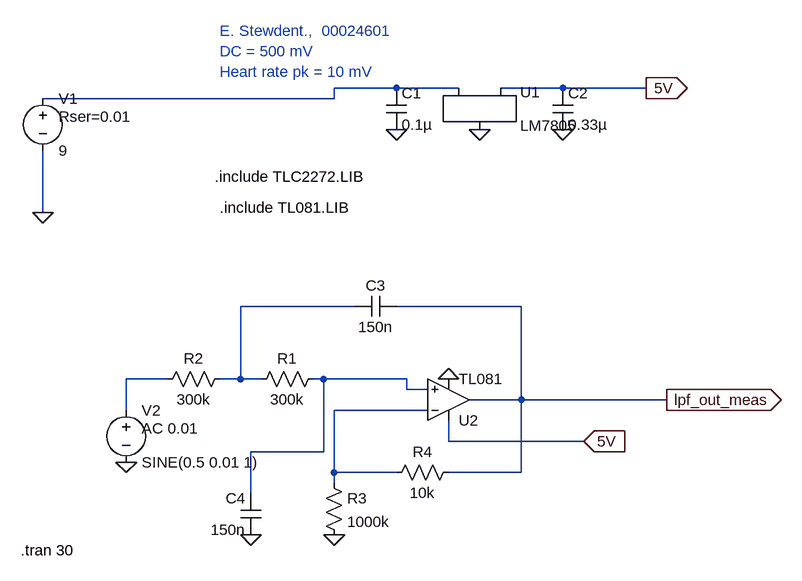
[diagram p0: schematic Test.asc]
Test.asc, the LTspice schematic file:
Version 4
SHEET 1 2136 680
WIRE 368 -1104 272 -1104
WIRE 464 -1104 368 -1104
WIRE 624 -1104 528 -1104
WIRE 752 -1104 624 -1104
WIRE 272 -1088 272 -1104
WIRE 272 -1088 -176 -1088
WIRE -176 -912 -176 -1008
WIRE 304 -768 128 -768
WIRE 560 -768 368 -768
WIRE 16 -656 -48 -656
WIRE 128 -656 128 -768
WIRE 128 -656 96 -656
WIRE 160 -656 128 -656
WIRE 256 -656 240 -656
WIRE 384 -656 256 -656
WIRE 384 -640 384 -656
WIRE 416 -640 384 -640
WIRE 560 -624 560 -768
WIRE 560 -624 480 -624
WIRE 784 -624 560 -624
WIRE -48 -608 -48 -656
WIRE 416 -608 272 -608
WIRE 448 -560 448 -592
WIRE 656 -560 448 -560
WIRE 256 -544 256 -656
WIRE 256 -544 144 -544
WIRE 272 -512 272 -608
WIRE 368 -512 272 -512
WIRE 560 -512 560 -624
WIRE 560 -512 448 -512
WIRE 272 -496 272 -512
WIRE 144 -480 144 -544
FLAG 496 -1040 0
FLAG 368 -1040 0
FLAG 624 -1040 0
FLAG 752 -1104 5V
IOPIN 752 -1104 Out
FLAG 448 -656 0
FLAG 144 -416 0
FLAG 272 -416 0
FLAG 656 -560 5V
IOPIN 656 -560 In
FLAG -176 -912 0
FLAG 784 -624 lpf_out_meas
IOPIN 784 -624 Out
FLAG -48 -528 0
SYMBOL LM7805 496 -1088 R0
SYMATTR InstName U1
SYMBOL cap 352 -1104 R0
SYMATTR InstName C1
SYMATTR Value 0.1µ
SYMBOL cap 608 -1104 R0
SYMATTR InstName C2
SYMATTR Value 0.33µ
SYMBOL Opamps\\opamp2 448 -560 M180
SYMATTR InstName U2
SYMATTR Value TL081
SYMBOL res 144 -640 R270
WINDOW 0 32 56 VTop 2
WINDOW 3 0 56 VBottom 2
SYMATTR InstName R1
SYMATTR Value 300k
SYMBOL res 0 -640 R270
WINDOW 0 32 56 VTop 2
WINDOW 3 0 56 VBottom 2
SYMATTR InstName R2
SYMATTR Value 300k
SYMBOL cap 368 -784 R90
WINDOW 0 0 32 VBottom 2
WINDOW 3 32 32 VTop 2
SYMATTR InstName C3
SYMATTR Value 150n
SYMBOL cap 160 -416 R180
WINDOW 0 24 56 Left 2
WINDOW 3 24 8 Left 2
SYMATTR InstName C4
SYMATTR Value 150n
SYMBOL res 256 -512 R0
SYMATTR InstName R3
SYMATTR Value 1000k
SYMBOL res 464 -528 R90
WINDOW 0 0 56 VBottom 2
WINDOW 3 32 56 VTop 2
SYMATTR InstName R4
SYMATTR Value 10k
SYMBOL voltage -176 -1104 R0
WINDOW 123 0 0 Left 0
WINDOW 39 24 44 Left 2
SYMATTR SpiceLine Rser=0.01
SYMATTR InstName V1
SYMATTR Value 9
SYMBOL voltage -48 -624 R0
WINDOW 123 24 44 Left 2
WINDOW 39 0 0 Left 0
SYMATTR Value2 AC 0.01
SYMATTR InstName V2
SYMATTR Value SINE(0.5 0.01 1)
TEXT 96 -1192 Left 2 ;E. Stewdent.,  00024601\nDC = 500 mV\nHeart rate pk = 10 mV
TEXT 88 -968 Left 2 !.include TLC2272.LIB
TEXT 96 -920 Left 2 !.include TL081.LIB
TEXT -210 -392 Left 2 !.tran 30

The netlist it stands for:
* Test.asc
XU1 N001 0 5V LM7805
C1 N001 0 0.1µ
C2 5V 0 0.33µ
XU2 N004 N005 5V 0 lpf_out_meas TL081  ; pins In+ In- V+ V- OUT
R1 N002 N004 300k
R2 N003 N002 300k
C3 lpf_out_meas N002 150n
C4 0 N004 150n
R3 N005 0 1000k
R4 lpf_out_meas N005 10k
V1 N001 0 9 Rser=0.01
V2 N003 0 SINE(0.5 0.01 1) AC 0.01
* E. Stewdent.,  00024601
* DC = 500 mV
* Heart rate pk = 10 mV
.include TLC2272.LIB
.include TL081.LIB
.tran 30
.backanno
.end